# EAGLE design LEDDimmerDuoMini (EAGLE 6.6.0)
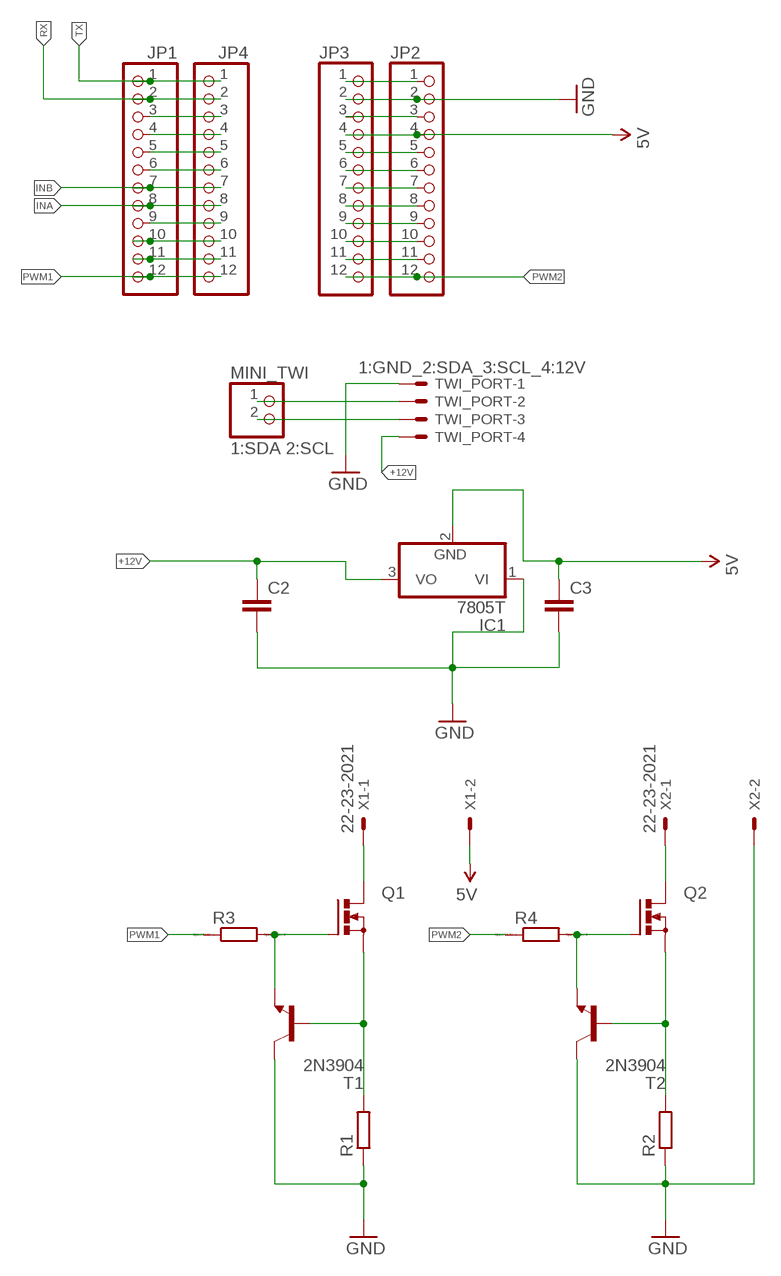
[diagram p0: schematic, sheet 1]

## Parts
C2  CAP0603-CAP  [0603-CAP]
C3  CAP0603-CAP  [0603-CAP]
IC1  7805T  [TO220H]
JP1  PINHD-1X12  [1X12]
JP2  PINHD-1X12  [1X12]
JP3  PINHD-1X12  [1X12]
JP4  PINHD-1X12  [1X12]
MINI_TWI  1:SDA 2:SCL  PINHD-1X2  [1X02]
Q1  PMOSFET_NTO220BV  [TO220BV]
Q2  PMOSFET_NTO220BV  [TO220BV]
R1  R-EU_VTA52  [VTA52]
R2  R-EU_VTA52  [VTA52]
R3  R  [R0805]
R4  R  [R0805]
T1  2N3904  [TO92]
T2  2N3904  [TO92]
TWI_PORT  1:GND_2:SDA_3:SCL_4:12V  22-23-2041  [22-23-2041]
X1  22-23-2021  [22-23-2021]
X2  22-23-2021  [22-23-2021]

## Nets
5V: C3.1 IC1.2(GND) JP2.4 JP3.4 X1.2
+12V: C2.1 IC1.3(VO) TWI_PORT.4
GND: C2.2 C3.2 IC1.1(VI) JP2.2 JP3.2 R1.1 R2.1 T1.1(C) T2.1(C) TWI_PORT.1 X2.2
INA: JP1.8 JP4.8
INB: JP1.7 JP4.7
N$2: MINI_TWI.1 TWI_PORT.2
N$3: MINI_TWI.2 TWI_PORT.3
N$4: Q1.S R1.2 T1.2(B)
N$5: Q2.S R2.2 T2.2(B)
N$6: JP1.3 JP4.3
N$7: Q2.G R4.2 T2.3(E)
N$8: JP1.4 JP4.4
N$9: JP1.5 JP4.5
N$10: JP1.11 JP4.11
N$11: JP1.10 JP4.10
N$12: JP1.6 JP4.6
N$13: JP1.9 JP4.9
N$15: JP2.1 JP3.1
N$17: JP2.3 JP3.3
N$19: JP2.5 JP3.5
N$20: JP2.6 JP3.6
N$21: JP2.7 JP3.7
N$22: JP2.8 JP3.8
N$23: JP2.9 JP3.9
N$24: JP2.10 JP3.10
N$25: JP2.11 JP3.11
N$26: Q1.D X1.1
N$27: Q2.D X2.1
PWM1: JP1.12 JP4.12 Q1.G R3.1 R3.2 T1.3(E)
PWM2: JP2.12 JP3.12 R4.1
RX: JP1.2 JP4.2
TX: JP1.1 JP4.1

## Library data of the parts
C2 C3 = SparkFun-Capacitors:CAP: Capacitor Standard 0603 ceramic capacitor, and 0.1" leaded capacitor.
IC1 = linear:78*: Positive VOLTAGE REGULATOR Source: http://cache.national.com/ds/LM/LM78L05.pdf http://www.fairchildsemi.com/ds/LM/LM7805.pdf
JP1-JP4 = pinhead:PINHD-1X12: PIN HEADER
MINI_TWI = pinhead:PINHD-1X2: PIN HEADER
Q1 Q2 = transistor-power:PMOSFET_N: Power MOSFET N-Channel
R1 R2 = rcl:R-EU_: RESISTOR, European symbol
R3 R4 = eagle-ltspice:R: RESISTOR, European symbol; SPICEMODEL: NONE; SPICEPREFIX: R
T1 T2 = transistor:2N3904: NPN TRANSISTOR
TWI_PORT = con-molex:22-23-2041: .100" (2.54mm) Center Header - 4 Pin; MF: MOLEX; MPN: 22-23-2041; OC_FARNELL: 1462920; OC_NEWARK: 38C0355
X1 X2 = con-molex:22-23-2021: .100" (2.54mm) Center Header - 2 Pin; MF: MOLEX; MPN: 22-23-2021; OC_FARNELL: 1462926; OC_NEWARK: 25C3832

## Net classes
0 default: width 0.508 mm, drill 0.508 mm, clearance 0.762 mm

## Board
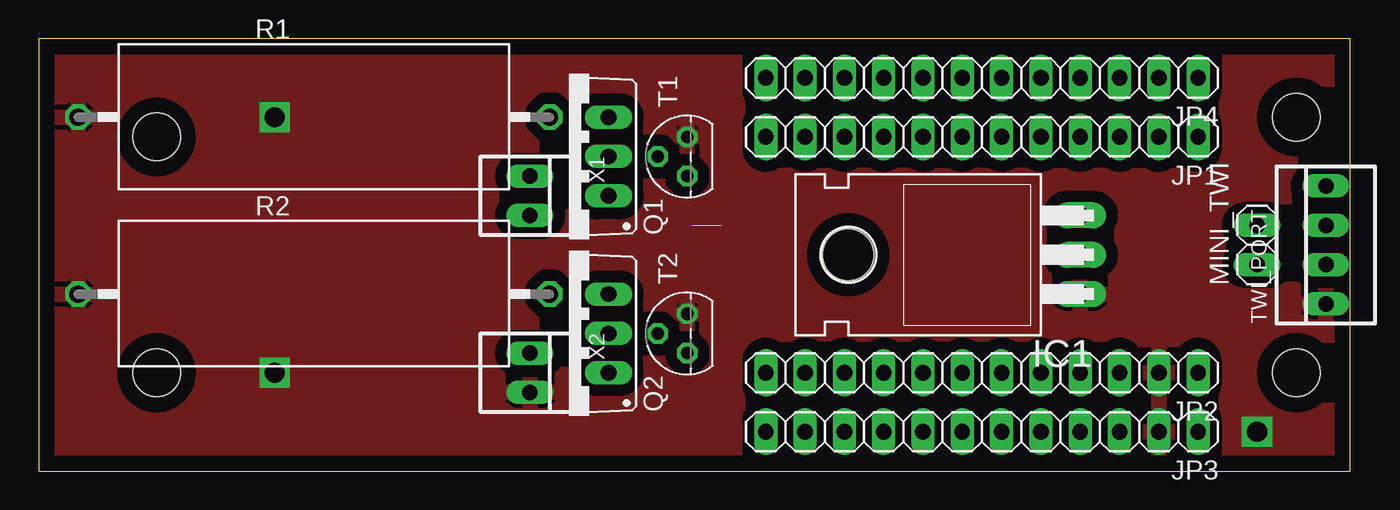
[diagram p1: board, top side]
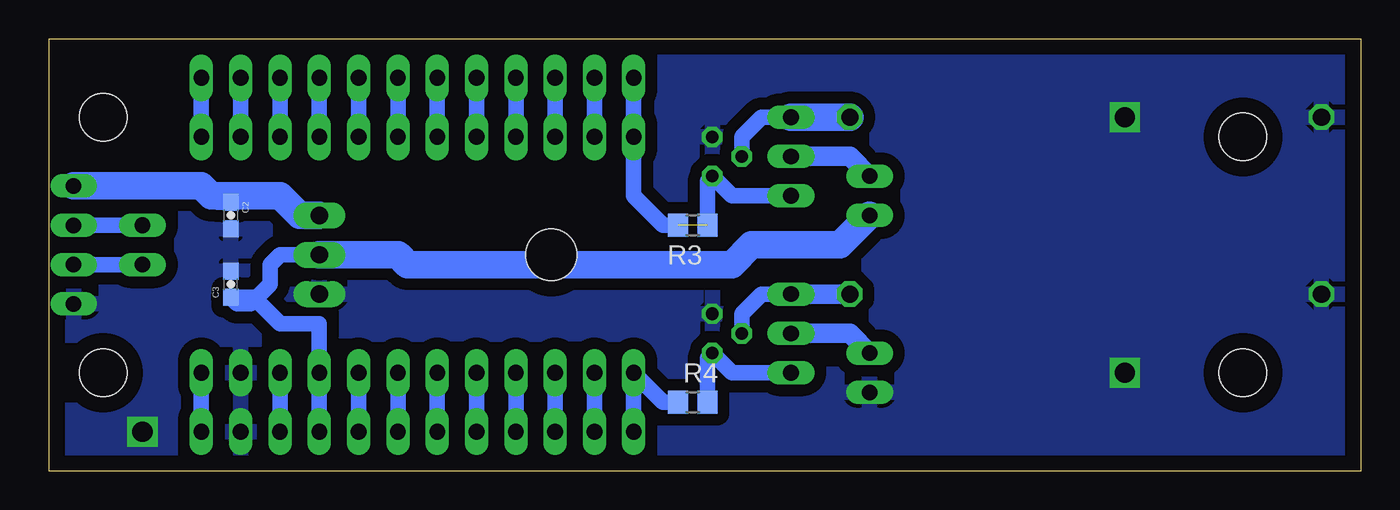
[diagram p2: board, bottom side, seen from below]

Size 84.76 x 27.93 mm. Coordinates in mm from the lower left corner, seen from the top.
Outline: 0,0 84.76,0 84.76,27.93 0,27.93 0,0
Copper layers (1*16): Top 0.035mm / dielectric 1.5mm / Bottom 0.035mm
Design rules "default": minimum track width 10mil, minimum drill 24mil, track to track 8mil, track to pad 8mil, pad to pad 8mil, via to via 8mil, smd to smd 8mil, copper to edge 40mil, drill to drill 8mil, minimum pad ring 10mil, minimum via ring 8mil, stop-mask expansion 4mil, vias tented up to drill 0mil, thermal gap 10mil
Holes 3.05 mm at 81.28,6.35 81.28,22.86 7.62,6.35 7.62,21.59

### Footprints (pad centres in the part's own frame; a part is rotated, then mirrored left to right if it is on the bottom)
0603-CAP = smd 1.1 x 1: 1 -0.85,0; 2 0.85,0
TO220H = drill 1.118 long: 1 -2.54,-10.16; 2 0,-10.16; 3 2.54,-10.16 | hole 3.302: 0,4.826
1X12 = drill 1.016 long: 1 -13.97,0; 2 -11.43,0; 3 -8.89,0; 4 -6.35,0; 5 -3.81,0; 6 -1.27,0; 7 1.27,0; 8 3.81,0; 9 6.35,0; 10 8.89,0; 11 11.43,0; 12 13.97,0
1X02 = drill 1.016 long: 1 -1.27,0; 2 1.27,0
TO220BV = drill 1.016 long: D 0,-2.54; G -2.54,-2.54; S 2.54,-2.54
VTA52 = drill 1.1 octagon: 1 -15.24,0; 2 15.24,0
R0805 = smd 1.3 x 1.5: 1 -0.95,0; 2 0.95,0
TO92 = drill 0.813 octagon: 1 1.27,0; 2 0,1.905; 3 -1.27,0
22-23-2041 = drill 1 long: 1 -3.81,0; 2 -1.27,0; 3 1.27,0; 4 3.81,0
22-23-2021 = drill 1 long: 1 -1.27,0; 2 1.27,0

### Placement (x,y rotation side)
C2  73.03,16.51 270 bottom
C3  73.03,12.06 90 bottom
IC1  57.15,13.97 90 top
JP1  60.96,21.59 180 top
JP2  60.96,6.35 180 top
JP3  60.96,2.54 180 top
JP4  60.96,25.4 180 top
MINI_TWI  78.74,14.61 90 top
Q1  34.29,20.32 90 top
Q2  34.29,8.89 90 top
R1  17.78,22.86 0 top
R2  17.78,11.43 0 top
R3  43.18,15.88 180 bottom
R4  43.18,4.45 0 bottom
T1  41.91,20.32 90 top
T2  41.91,8.89 90 top
TWI_PORT  83.19,14.61 90 top
X1  31.75,17.78 270 top
X2  31.75,6.35 270 top

### Tracks (layer width: path | path; a pad name or v marks a point on that pad's centre or on a via)
5V
  Bottom 1.016: JP3.4 JP2.4 67.31,9.53 69.85,9.53 71.54,11.21 C3.1 72.61,10.79 71.75,10.79 70.48,12.06 70.48,13.34 69.85,13.97 IC1.2
  Bottom 1.778: X1.2 33.66,14.61 39.37,14.61 40.64,13.34 61.59,13.34 62.23,13.97 IC1.2
+12V
  Bottom 1.016: C2.1 73.88,17.36 74.61,18.1
  Bottom 1.778: TWI_PORT.4 74.93,18.41 74.61,18.1 74.3,17.78 69.85,17.78 68.58,16.51 IC1.3
GND  (via drill 1.3)
  other vias: 15.24,22.86 15.24,6.35 78.74,2.54
  pour Top: 0,27.94 85.09,27.94 85.09,0 0,0
  pour Bottom: 0,27.94 85.09,27.94 85.09,0 0,0
INA
  Bottom 1.016: JP4.8 JP1.8
INB
  Bottom 1.016: JP4.7 JP1.7
N$2
  Bottom 1.016: TWI_PORT.2 MINI_TWI.1
N$3
  Bottom 1.016: TWI_PORT.3 MINI_TWI.2
N$4
  Bottom 1.016: Q1.S 38.73,22.86 40.01,21.59 T1.2
  Bottom 1.778: R1.2 Q1.S
N$5
  Bottom 1.016: Q2.S 38.73,11.43 40.01,10.16 T2.2
  Bottom 1.27: Q2.S R2.2
N$6
  Bottom 1.016: JP4.3 JP1.3
N$7
  Bottom 1.016: R4.2 42.23,7.3 T2.3 40.64,6.35 Q2.G
N$8
  Bottom 1.016: JP4.4 JP1.4
N$9
  Bottom 1.016: JP4.5 JP1.5
N$10
  Bottom 1.016: JP4.11 JP1.11
N$11
  Bottom 1.016: JP4.10 JP1.10
N$12
  Bottom 1.016: JP4.6 JP1.6
N$13
  Bottom 1.016: JP4.9 JP1.9
N$15
  Bottom 1.016: JP2.1 JP3.1
N$17
  Bottom 1.016: JP3.3 JP2.3
N$19
  Bottom 1.016: JP3.5 JP2.5
N$20
  Bottom 1.016: JP3.6 JP2.6
N$21
  Bottom 1.016: JP3.7 JP2.7
N$22
  Bottom 1.016: JP3.8 JP2.8
N$23
  Bottom 1.016: JP3.9 JP2.9
N$24
  Bottom 1.016: JP3.10 JP2.10
N$25
  Bottom 1.016: JP2.11 JP3.11
N$26
  Bottom 1.27: X1.1 33.02,20.32 Q1.D
N$27
  Bottom 1.27: 34.29,8.89 Q2.D 33.02,8.89 X2.1
PWM1  (1 unrouted)
  Bottom 1.016: R3.2 45.09,15.88 46.99,17.78 JP1.12 JP4.12 | R3.1 42.23,18.73 T1.3 40.64,17.78 Q1.G
PWM2
  Bottom 1.016: R4.1 45.09,4.45 JP2.12 JP3.12
RX
  Bottom 1.016: JP4.2 JP1.2
TX
  Bottom 1.016: JP4.1 JP1.1